# Altium schematic sheet Sheet1.SCHDOC
size 297 x 209 mm; SheetNumber: 1; SheetTotal: 1; DocumentName: Sheet1.SCHDOC
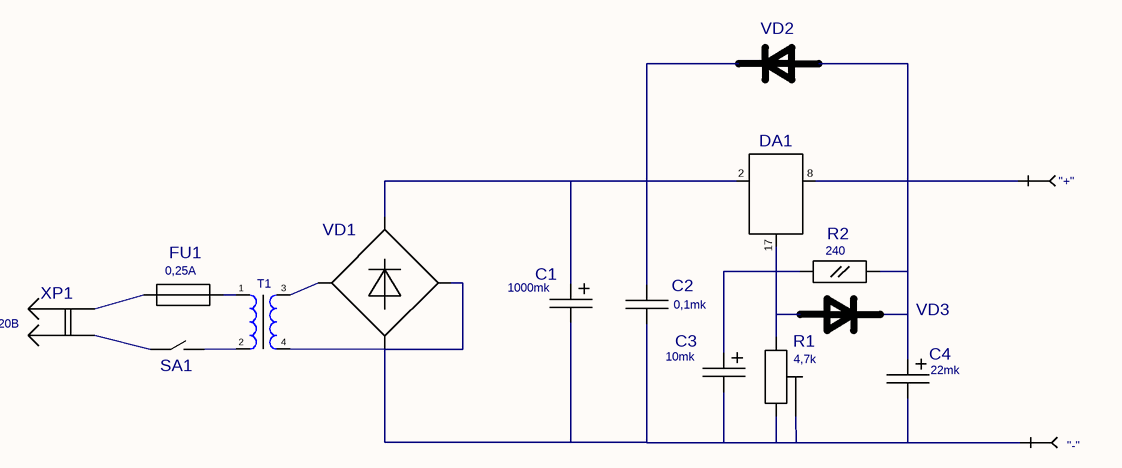
[diagram p0: Sheet1.SCHDOC]

## Parts
C1  value 1000mk  [K5035-3]  (hidden comment: K5035-10)
C2  value 0,1mk  [K1047-1]  (hidden comment: K1047-1)
C3  value 10mk  [K534A-2]  (hidden comment: K534A-2)
C4  value 22mk  [K534A-2]  (hidden comment: K534A-2)
DA1  КР142ЕНB  [KR142EN]  (value not drawn)
FU1  value 0,25A  [FH-101C]  (hidden comment: FH-101C)
R1  value 4,7k  [SP5-16-025]  (hidden comment: СП5-16-0,25)
R2  value 240  [C2-33H-0.125W]  (hidden comment: C2-33H-0.125W_OLD_UGO)
SA1  8AS9M2RE  [8AS9M2RE]  (value not drawn)
U  value T1  [T]  (hidden comment: TR)
VD1  KC412  [KC412]  (value not drawn)
VD2  КД522Б  [КД521(522)]  (value not drawn)
VD3  КД522Б  [КД521(522)]  (value not drawn)
X1  value "-"  [30FMN]  (hidden comment: 30FMN)  (part B of 30)
X2  value "+"  [30FMN]  (hidden comment: 30FMN)  (part A of 30)
XP1  value ~~220B  [2XR]  (hidden comment: 2XR)

## Nets
NetC1_1: C1.1(I/OA) C2.1(I/OA) DA1.2(IN0) VD1.3(I/O3) VD2.2(K)
NetC1_2: C1.2(I/OB) C2.2(I/OB) C3.2(I/OB) C4.2(I/OB) R1.2 R1.3 U.4 VD1.1(I/O1) VD1.4(I/O4) X1.2(i/o)
NetC3_1: C3.1(I/OA) DA1.17(GND) R1.1 R2.1 VD3.1(A)
NetC4_1: C4.1(I/OA) DA1.8(OUT0) R2.2 VD2.1(A) VD3.2(K) X2.1(i/o)
NetFU1_1: FU1.1 XP1.2(I/O2)
NetFU1_2: FU1.2 U.1
NetSA1_1: SA1.1 U.2
NetSA1_2: SA1.2 XP1.1(I/O1)
NetU_3: U.3 VD1.2(I/O2)

## Library data of the parts
C1 = K5035-10: PDIF_TY: 11213
C2 = K1047-1: PDIF_TY: 11213
C3 C4 = K534A-2: PDIF_TY: 11245
R2 = C2-33H-0.125W_OLD_UGO: Autor: pcbdesigner.ru
DA1 = КР142ЕНB: Value: *
SA1 = 8AS9M2RE: Value: *; Author: pcbdesigner.ru
VD1 = KC412: Value: *
VD2 VD3 = КД522Б: Value: *